# EAGLE design cpu-OLED-rtm (EAGLE 7.6.0)
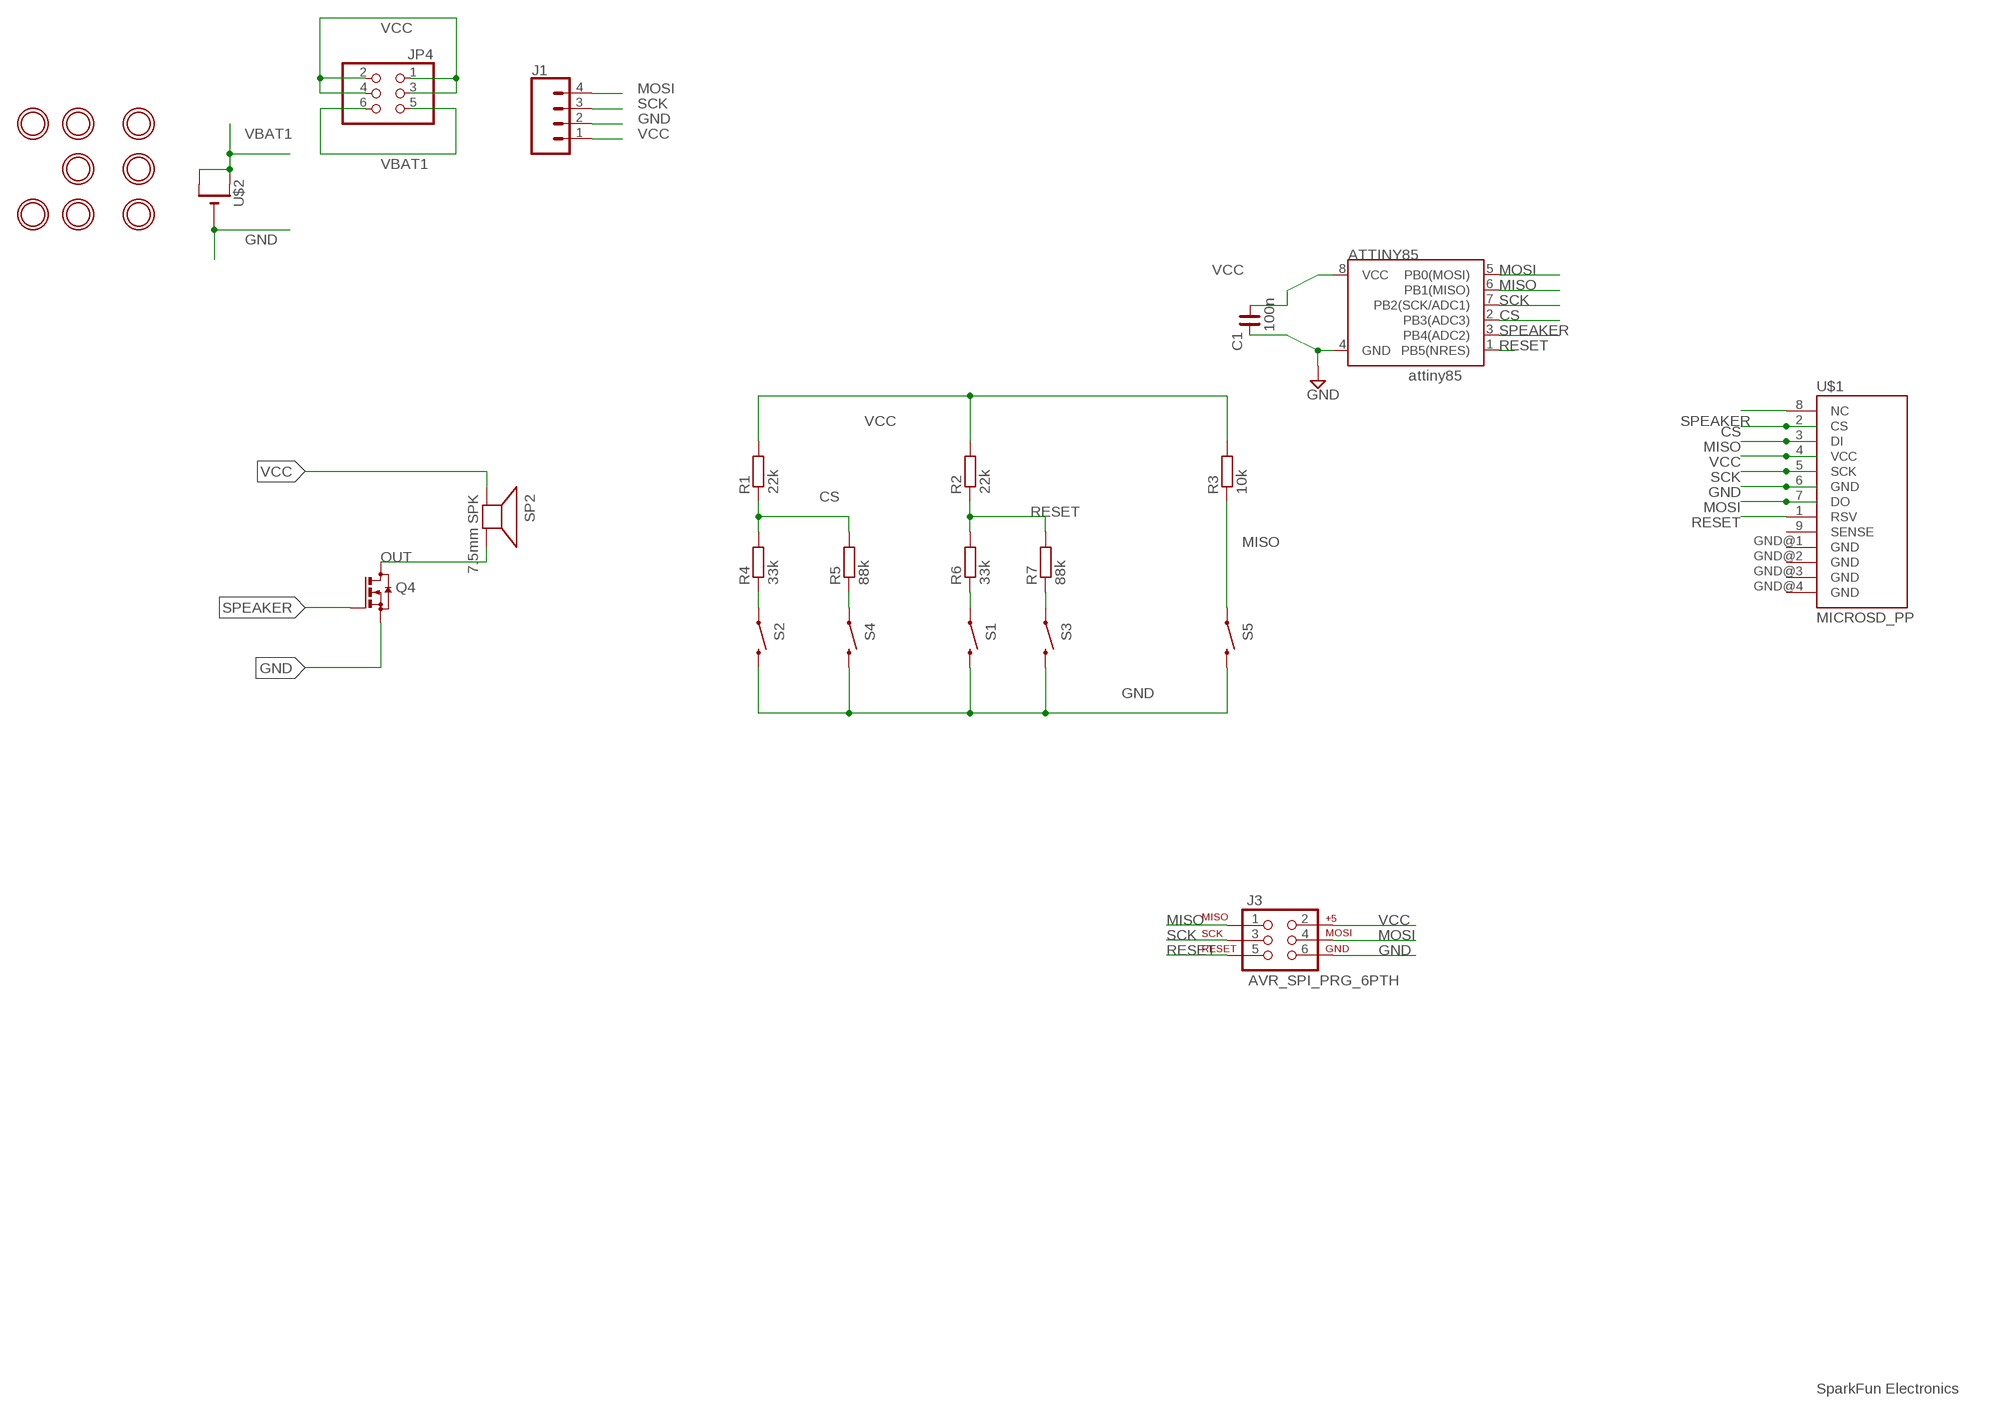
[diagram p0: schematic, sheet 1]

## Parts
ATTINY85  ATTINY45  [SO08-EIAJ]
C1  100n  C_0805  [C0805]
J1  CONN_041X04_NO_SILK  [1X04_NO_SILK]
J3  AVR_SPI_PRG_6PTH  [2X3]
JP4  PINHD-2X3  [2X03]
Q4  BSS123  [SOT23]
R1  22k  R-EU_R0805  [R0805]
R2  22k  R-EU_R0805  [R0805]
R3  10k  R-EU_R0805  [R0805]
R4  33k  R-EU_R0805  [R0805]
R5  88k  R-EU_R0805  [R0805]
R6  33k  R-EU_R0805  [R0805]
R7  88k  R-EU_R0805  [R0805]
S1  SWITCH-MOMENTARY-2SMD-4  [TACTILE_SWITCH_TALL]
S2  SWITCH-MOMENTARY-2SMD-4  [TACTILE_SWITCH_TALL]
S3  SWITCH-MOMENTARY-2SMD-4  [TACTILE_SWITCH_TALL]
S4  SWITCH-MOMENTARY-2SMD-4  [TACTILE_SWITCH_TALL]
S5  SWITCH-MOMENTARY-2SMD-4  [TACTILE_SWITCH_TALL]
SP2  7.5mm SPK  SPEAKER_BUZZER5MM  [BUZZER_SMT_5MM]
U$1  MICROSD_PP  [MICROSD_PP]
U$2  CR2032THM  [CR2032-THRU]
U$3  MOUNTINGHOLE2.0  [MOUNTINGHOLE_2.0_PLATED]
U$4  MOUNTINGHOLE2.0  [MOUNTINGHOLE_2.0_PLATED]
U$5  MOUNTINGHOLE2.0  [MOUNTINGHOLE_2.0_PLATED]
U$6  MOUNTINGHOLE2.0  [MOUNTINGHOLE_2.0_PLATED]
U$7  MOUNTINGHOLE2.0  [MOUNTINGHOLE_2.0_PLATED]
U$8  MOUNTINGHOLE2.0  [MOUNTINGHOLE_2.0_PLATED]
U$9  MOUNTINGHOLE2.0  [MOUNTINGHOLE_2.0_PLATED]
U$11  MOUNTINGHOLE2.0  [MOUNTINGHOLE_2.0_PLATED]

## Nets
CS: ATTINY85.2(PB3(ADC3)) R1.1 R4.2 R5.2 U$1.2(CS)
GND: ATTINY85.4(GND) C1.2 J1.2 J3.6 Q4.2(S) S1.B2 S2.B2 S3.B2 S4.B2 S5.B2 U$1.6(GND) U$2.-
MISO: ATTINY85.6(PB1(MISO)) J3.1 R3.1 S5.A2 U$1.3(DI)
MOSI: ATTINY85.5(PB0(MOSI)) J1.4 J3.4 U$1.7(DO)
N$2: R4.1 S2.A2
N$3: R5.1 S4.A2
N$5: R6.1 S1.A2
N$6: R7.1 S3.A2
OUT: Q4.3(D) SP2.-
RESET: ATTINY85.1(PB5(NRES)) J3.5 R2.1 R6.2 R7.2 U$1.1(RSV)
SCK: ATTINY85.7(PB2(SCK/ADC1)) J1.3 J3.3 U$1.5(SCK)
SPEAKER: ATTINY85.3(PB4(ADC2)) Q4.1(G) U$1.8(NC)
VBAT1: JP4.5 JP4.6 U$2.+1(+) U$2.+2(+1)
VCC: ATTINY85.8(VCC) C1.1 J1.1 J3.2 JP4.1 JP4.2 JP4.3 JP4.4 R1.2 R2.2 R3.2 SP2.+ U$1.4(VCC)
Unconnected: U$1.9(SENSE) U$1.GND@1(GND) U$1.GND@2(GND) U$1.GND@3(GND) U$1.GND@4(GND)

## Notes on the sheet
- attiny85
- SparkFun Electronics

## Library data of the parts
ATTINY85 = SparkFun:ATTINY45: Atmel ATTiny45
C1 = rc-master-smd:C_: NON-POLARIZED CAP
J1 = SparkFun-Connectors:CONN_04: Multi connection point. Often used as Generic Header-pin footprint for 0.1 inch spaced/style header connections On any of the 0.1 inch spaced packages, you can populate with these: Break Away Headers - Straight <https://www.sparkfun.com/products/116> (PRT-00116) Break Away Male Headers - Right Angle <https://www.sparkfun.com/products/553> (PRT-00553) Female Headers <https://www.sparkfun.com/products/115> (PRT-00115) Break Away Headers - Machine Pin <https://www.sparkfun.com/products/117> (PRT-00117) Break Away Female Headers - Swiss Machine Pin <https://www.sparkfun.com/products/743> (PRT-00743) For SCREWTERMINALS and SPRING TERMINALS visit here: Screw Terimnals on SparkFun.com <https://www.sparkfun.com/search/results?term=Screw+Terminals> (5mm/3.5mm/2.54mm spacing) This device is also useful as a general connection point to wire up your design to another part of your project. Our various solder wires solder well into these plated through hole pads. Hook-Up Wire - Assortment (Stranded, 22 AWG) <https://www.sparkfun.com/products/11375> (PRT-11375) Hook-Up Wire - Assortment (Solid Core, 22 AWG) <https://www.sparkfun.com/products/11367> (PRT-11367) View the entire wire category on our website here <https://www.sparkfun.com/categories/141> Special notes: Molex polarized connector foot print use with SKU : PRT-08231 with associated crimp pins and housings. 1MM SMD Version SKU: PRT-10208; PROD_ID: CONN-09696
J3 = SparkFun-Connectors:AVR_SPI_PRG_6: AVR ISP 6 Pin This is the reduced ISP connector for AVR programming. Common on Arduino. This footprint will take up less PCB space and can be used with a 10-pin to 6-pin adapter such as SKU: BOB-08508 **Special note about "TEST_POINT" package. The stop mask is on the top side, so if you want your programming test points to be on the bottom of your board, make sure to place this package on the bottom side of the board. This also ensure that the orientation to program from the bottom side will be correct.
JP4 = pinhead:PINHD-2X3: PIN HEADER
Q4 = transistor-small-signal:BSS123: N-CHANNEL MOS FET
R1-R7 = resistor:R-EU_: RESISTOR, European symbol
S1-S5 = SparkFun-Electromechanical:SWITCH-MOMENTARY-2: Various NO switches- pushbuttons, reed, etc; PROD_ID: SWCH-11966
SP2 = microbuilder:SPEAKER: SPEAKER Source: Buerklin Added PS12 (for part # PS1240 piezo) http://www.ladyada.net/library/pcb/eaglelibrary.html
U$1 = DE1594-v2:MICROSD_PP
U$2 = adafruit:CR2032
U$3-U$9 U$11 = microbuilder:MOUNTINGHOLE: Mounting Hole

## Net classes
0 default: width 0.203 mm, drill 0.356 mm, clearance 0.203 mm
1 vcc: width 0.254 mm, drill 0.356 mm, clearance 0.254 mm
2 gnd: width 0.254 mm, drill 0.356 mm, clearance 0.356 mm

## Board
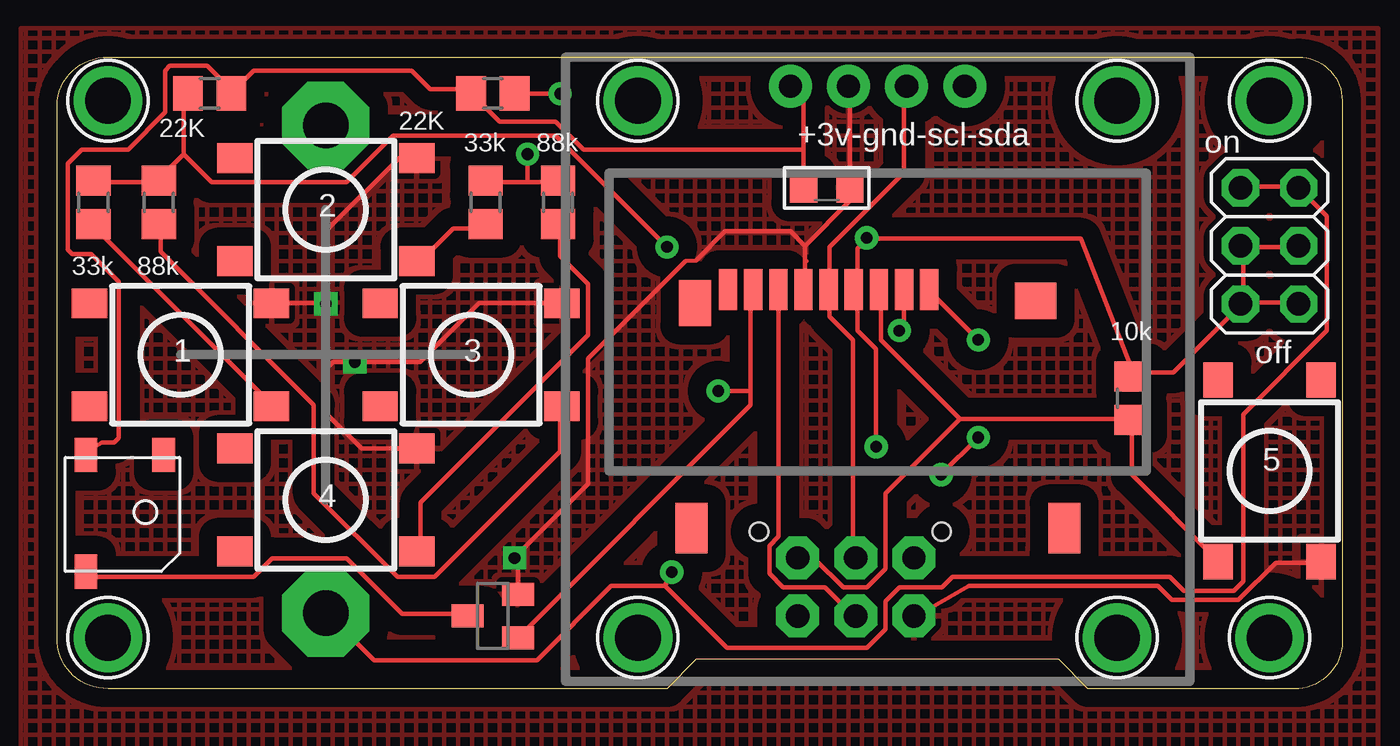
[diagram p1: board, top side]
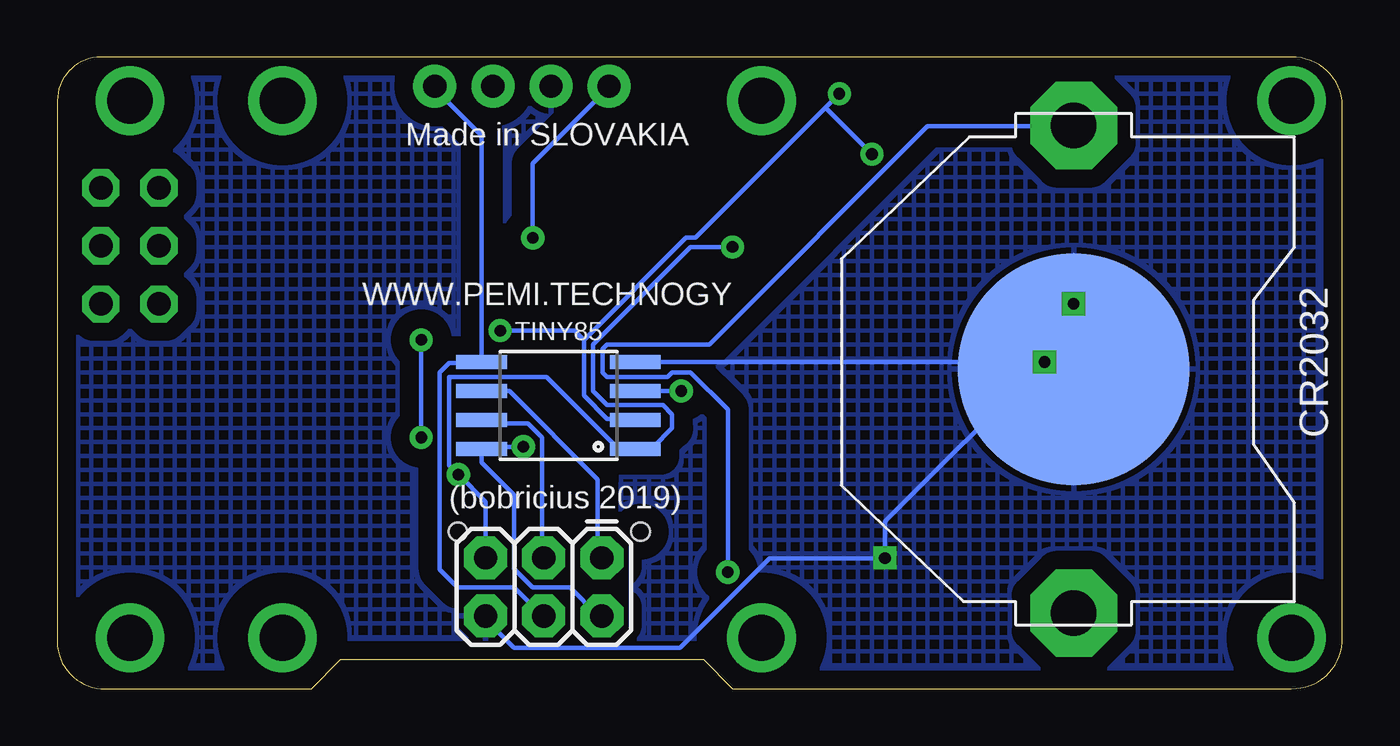
[diagram p2: board, bottom side, seen from below]

Size 56.2 x 27.62 mm. Coordinates in mm from the lower left corner, seen from the top.
Outline: 0,25.72 arc-83 2.22,27.62 54.29,27.62 arc-90 56.2,25.72 56.2,2.22 arc-90 54.29,0 45.09,0 43.81,1.27 27.94,1.27 26.67,0 2.22,0 arc-93 0,2.22 0,25.72
Copper layers (1*16): Top 0.035mm / dielectric 1.5mm / Bottom 0.035mm
Design rules "SparkFun": minimum track width 8mil, minimum drill 20mil, track to track 8mil, track to pad 8mil, pad to pad 8mil, via to via 8mil, smd to smd 8mil, copper to edge 9mil, drill to drill 8mil, minimum pad ring 12mil, minimum via ring 10mil, stop-mask expansion 4mil, vias tented up to drill 20mil, thermal gap 10mil

### Footprints (pad centres in the part's own frame; a part is rotated, then mirrored left to right if it is on the bottom)
SO08-EIAJ = smd 0.61 x 2.21: 1 -1.905,-3.378; 2 -0.635,-3.378; 3 0.635,-3.378; 4 1.905,-3.378; 5 1.905,3.353; 6 0.635,3.353; 7 -0.635,3.353; 8 -1.905,3.353
C0805 = smd 1.2 x 1.3: 1 -1.016,0; 2 1.016,0
1X04_NO_SILK = drill 1.016 pad 1.88: 1 0,0; 2 2.54,0; 3 5.08,0; 4 7.62,0
2X3 = drill 1.016 pad 1.88 octagon: 1 0,0; 2 0,2.54; 3 2.54,0; 4 2.54,2.54; 5 5.08,0; 6 5.08,2.54
2X03 = drill 1.016 octagon: 1 -2.54,-1.27; 2 -2.54,1.27; 3 0,-1.27; 4 0,1.27; 5 2.54,-1.27; 6 2.54,1.27
SOT23 = smd 1 x 1.4: 1 -0.95,-1.1; 2 0.95,-1.1; 3 0,1.1
R0805 = smd 1.3 x 1.5: 1 -0.95,0; 2 0.95,0
TACTILE_SWITCH_TALL = smd 1.55 x 1.3: A1 -3.975,-2.25; A2 3.975,-2.25; B1 -3.975,2.25; B2 3.975,2.25
BUZZER_SMT_5MM = smd 1.5 x 1: + -2.6,-1.6; - 2.5,-1.6; MT -2.6,1.8
MICROSD_PP = smd 1.8 x 0.8: 1 0,3.85; 2 0,2.75; 3 0,1.65; 4 0,0.55; 5 0,-0.55; 6 0,-1.65; 7 0,-2.75; 8 0,-3.85; 9 0,-4.95 | smd 1.6 x 1.8: GND@1 0.5,8.5 | smd 2.2 x 1.4: GND@2 10.45,9.75; GND@4 10.45,-6.55 | smd 2 x 1.4: GND@3 0.6,-6.4 | hole 0.8: 10.6,4.4; 10.6,-3.6
CR2032-THRU = drill 2 pad 3.81 octagon: +1 -10.668,0; +2 10.668,0 | smd 10.16 x 10.16: - 0,0
MOUNTINGHOLE_2.0_PLATED = drill 2 pad 3: P$1 0,0

### Placement (x,y rotation side)
ATTINY85  34.29,12.38 90 bottom
C1  33.66,21.91 0 top
J1  32.07,26.35 0 top
J3  32.39,5.71 180 bottom
JP4  53.02,19.37 90 top
Q4  19.05,3.17 90 top
R1  19.05,26.03 180 top
R2  6.67,26.03 0 top
R3  46.99,12.7 90 top
R4  18.73,21.27 90 top
R5  21.91,21.27 90 top
R6  1.59,21.27 90 top
R7  4.45,21.27 90 top
S1  5.4,14.61 0 top
S2  11.75,20.95 0 top
S3  18.1,14.61 0 top
S4  11.75,8.25 0 top
S5  53.02,9.52 270 top
SP2  2.86,7.62 270 top
U$1  34.29,17.46 270 top
U$2  11.75,13.97 270 bottom
U$3  25.4,2.22 90 top
U$4  46.36,2.22 90 top
U$5  2.22,2.22 0 top
U$6  25.4,25.72 90 top
U$7  2.22,25.72 0 top
U$8  53.02,2.22 0 top
U$9  46.36,25.72 90 top
U$11  53.02,25.72 90 top

### Tracks (layer width: path | path; a pad name or v marks a point on that pad's centre or on a via)
CS  (via drill 0.51)
  Top 0.203: 20.57,22.16 21.79,22.16 R5.2 | 20.57,22.16 18.75,22.16 R4.2 | v22,26.02 20.17,26.02 R1.1 | v36.83,15.66 37.03,15.86 37.03,17.28 U$1.2 | v20.57,23.38 20.57,22.16
  Bottom 0.203: 22.61,25.41 28.3,19.72 28.7,19.72 33.17,15.25 | 22.61,25.41 v22,26.02 | 33.17,15.25 33.17,12.81 32.16,11.8 30.94,11.8 ATTINY85.2 | v36.83,15.66 33.58,15.66 33.17,15.25 | 22.61,25.41 v20.57,23.38
GND  (via drill 0.51)
  Top 0.203: S1.B2 11.75,16.86 v11.75,16.83 11.75,20 14.95,23.2 S2.B2 | S3.B2 18.44,16.86 15.88,14.29 v13.02,14.29 12.06,14.29 U$2.- 11.75,12.07 13.31,10.5 S4.B2 | Q4.2 20.15,5.57 v20,5.72 20.17,5.91 23.22,8.95 23.22,14.44 27.48,18.71 27.94,18.73 29.21,20 32.07,20 32.7,19.37 | J1.2 34.67,26.35 C1.2 34.67,21.34 32.7,19.37 | 32.7,18.71 32.7,17.52 U$1.6 | 32.7,19.37 32.7,18.71 | 32.77,18.71 32.7,18.71 | S5.B2 55.12,5.5 53.29,5.5 51.66,3.87 48.76,3.87 48.15,4.48 39.88,4.48 37.64,3.2 J3.6
  Bottom 0.203: ATTINY85.4 v13.02,14.29 | v13.02,14.29 11.75,14.29 U$2.- | v11.75,16.83 U$2.- | v13.02,14.29 12.06,14.29 U$2.- | v13.02,14.29 20,7.3 v20,5.72 20.17,5.7 25.04,5.7 28.97,1.78 36.22,1.78 37.44,3 J3.6
  pour Top (isolate 0.813, hatched): -1.59,28.89 57.79,28.89 57.79,-2.86 -1.59,-2.86
  pour Bottom (isolate 0.813, hatched): 57.79,29.84 -1.59,29.84 -1.59,-1.91 57.79,-1.91
MISO
  Top 0.203: S5.A2 50.65,5.7 46.99,9.36 R3.1 46.99,11.8 39.47,11.8 | 39.47,11.8 36.02,15.25 36.02,17.28 U$1.3 | 39.47,11.8 36.22,8.55 36.22,5.23 35.41,4.42 34.39,4.42 33.17,5.64 32.56,5.64 J3.1
  Bottom 0.203: ATTINY85.6 36.42,13.02 32.56,9.16 32.56,5.84 J3.1
MOSI
  Top 0.203: U$1.7 31.55,17.28 31.55,6.65 31.14,6.25 31.14,5.03 31.75,4.42 33.58,4.42 34.8,3.2 J3.4
  Bottom 0.203: J1.4 39.68,26.23 37.64,24.19 ATTINY85.5 37.64,14.24 39.06,14.24 39.47,13.83 39.47,5.21 38.68,4.42 36.22,4.42 35,3.2 J3.4
N$2
  Top 0.203: R4.1 18.54,20.13 17.32,20.13 15.9,18.71 S2.A2
N$3
  Top 0.203: R5.1 22,20.13 22,18.91 23.22,17.69 23.22,15.46 15.9,8.14 15.9,6.11 S4.A2
N$5
  Top 0.203: R6.1 1.68,20.13 9.4,12.41 S1.A2
N$6
  Top 0.203: R7.1 4.52,20.13 4.52,19.11 11.23,12.41 11.23,8.55 14.88,4.89 16.51,4.89 22,10.38 22,12.2 S3.A2
OUT
  Top 0.203: Q4.3 17.93,3.26 15.09,3.26 12.65,5.7 9.4,5.7 8.59,4.89 1.47,4.89 1.27,5.09 SP2.-
RESET  (via drill 0.51)
  Top 0.203: R6.2 1.68,22.16 4.32,22.16 R7.2 4.52,22.36 5.54,23.38 | 5.54,23.38 5.54,26.02 R2.1 | v40.28,15.25 38.25,17.28 U$1.1 | v38.66,9.36 v40.28,10.99 | 5.54,23.38 6.76,22.16 12.65,22.16 14.68,24.19 21.79,24.19 v26.67,19.32
  Bottom 0.203: v40.28,10.99 v40.28,15.25 | v26.67,19.32 28.5,19.32 32.77,15.05 32.77,13.02 32.16,12.41 29.72,12.41 29.31,12 29.31,11.39 30.12,10.58 30.73,10.58 ATTINY85.1 30.94,10.58 31.75,10.58 34.8,13.63 39.06,13.63 39.06,9.77 v38.66,9.36 37.47,8.17 J3.5
SCK
  Top 0.203: J1.3 37.03,26.23 37.03,22.57 33.78,19.32 33.78,17.49 U$1.5 33.78,17.28 33.78,16.27 34.8,15.25 34.8,5.84 J3.3
  Bottom 0.203: ATTINY85.7 37.64,11.6 35.61,11.6 35,10.99 35,5.84 J3.3
SPEAKER  (via drill 0.51)
  Top 0.203: 30.33,13.02 30.33,17.28 U$1.8 | 30.33,13.02 30.33,12.41 20.17,2.25 Q4.1 | 30.33,13.02 v28.91,13.02
  Bottom 0.203: v28.91,13.02 ATTINY85.3
VBAT1  (via drill 0.51)
  Top 0.203: JP4.6 51.87,21.96 54.1,21.96 JP4.5 54.31,21.76 54.31,21.89 55.52,20.68 55.52,15.66 51.87,12 51.87,4.69 51.46,4.28 49.28,4.28 48.67,4.89 39.15,4.89 38.68,4.42 36.83,4.42 36.22,3.81 36.22,2.59 35.41,1.78 29.29,1.78 26.58,4.48 | 26.58,4.48 24.23,4.48 20.98,1.23 13.87,1.23 11.84,3.26 U$2.+2 | 26.58,4.48 v26.87,5.09
  Bottom 0.203: v26.87,5.09 26.87,12.2 28.5,13.83 29.31,13.83 29.52,13.63 32.16,13.63 32.36,13.83 32.36,14.85 32.16,15.05 27.69,15.05 18.14,24.6 11.84,24.6 U$2.+1
VCC  (via drill 0.51)
  Top 0.203: J1.1 32.64,26.35 32.64,23.58 | 32.64,23.58 C1.1 | 51.87,19.32 54.1,19.32 JP4.3 | 46.99,13.83 48.82,13.83 51.66,16.68 JP4.2 51.87,16.88 | 35.41,19.66 35,19.25 35,17.49 U$1.4 35,17.28 35,15.66 35.81,14.85 v35.81,10.58 | 35.41,19.66 35.56,19.66 35.56,19.69 44.77,19.69 46.99,13.97 46.99,13.83 | 46.99,13.83 R3.2 | 51.87,16.88 54.1,16.88 JP4.1 | 51.87,16.88 51.87,19.32 | 51.87,19.32 JP4.4 | SP2.+ 1.27,10.38 1.97,10.76 2.49,10.76 2.69,10.96 2.69,17.81 1.5,19 0.66,19 0.46,19.2 0.46,22.97 1.07,23.58 3.1,23.58 4.72,25.21 4.72,27.04 4.93,27.24 6.55,27.24 7.57,26.23 R2.2 7.77,26.23 8.59,27.04 15.51,27.04 16.32,26.23 17.93,26.23 R1.2 18.14,26.02 19.36,24.8 21.79,24.8 23.01,23.58 32.64,23.58 | v35.41,19.72 35.41,19.66
  Bottom 0.203: J3.2 32.56,3.2 33.78,4.42 35.41,4.42 36.22,5.23 36.22,8.47 37.64,9.89 ATTINY85.8 37.64,10.58 v35.81,10.58 | v35.41,19.72 35.41,22.97 32.16,26.23 J1.1

### Text on the board
tNames: 22K | 22K | +3v-gnd-scl-sda | on | 33k | 88k | 2 | 33k | 88k | 10k | off | 1 | 3 | 5 | 4
bNames: Made in SLOVAKIA | WWW.PEMI.TECHNOGY | TINY85 | CR2032 | (bobricius 2019)